# EAGLE design sonar_array (EAGLE 5.09)
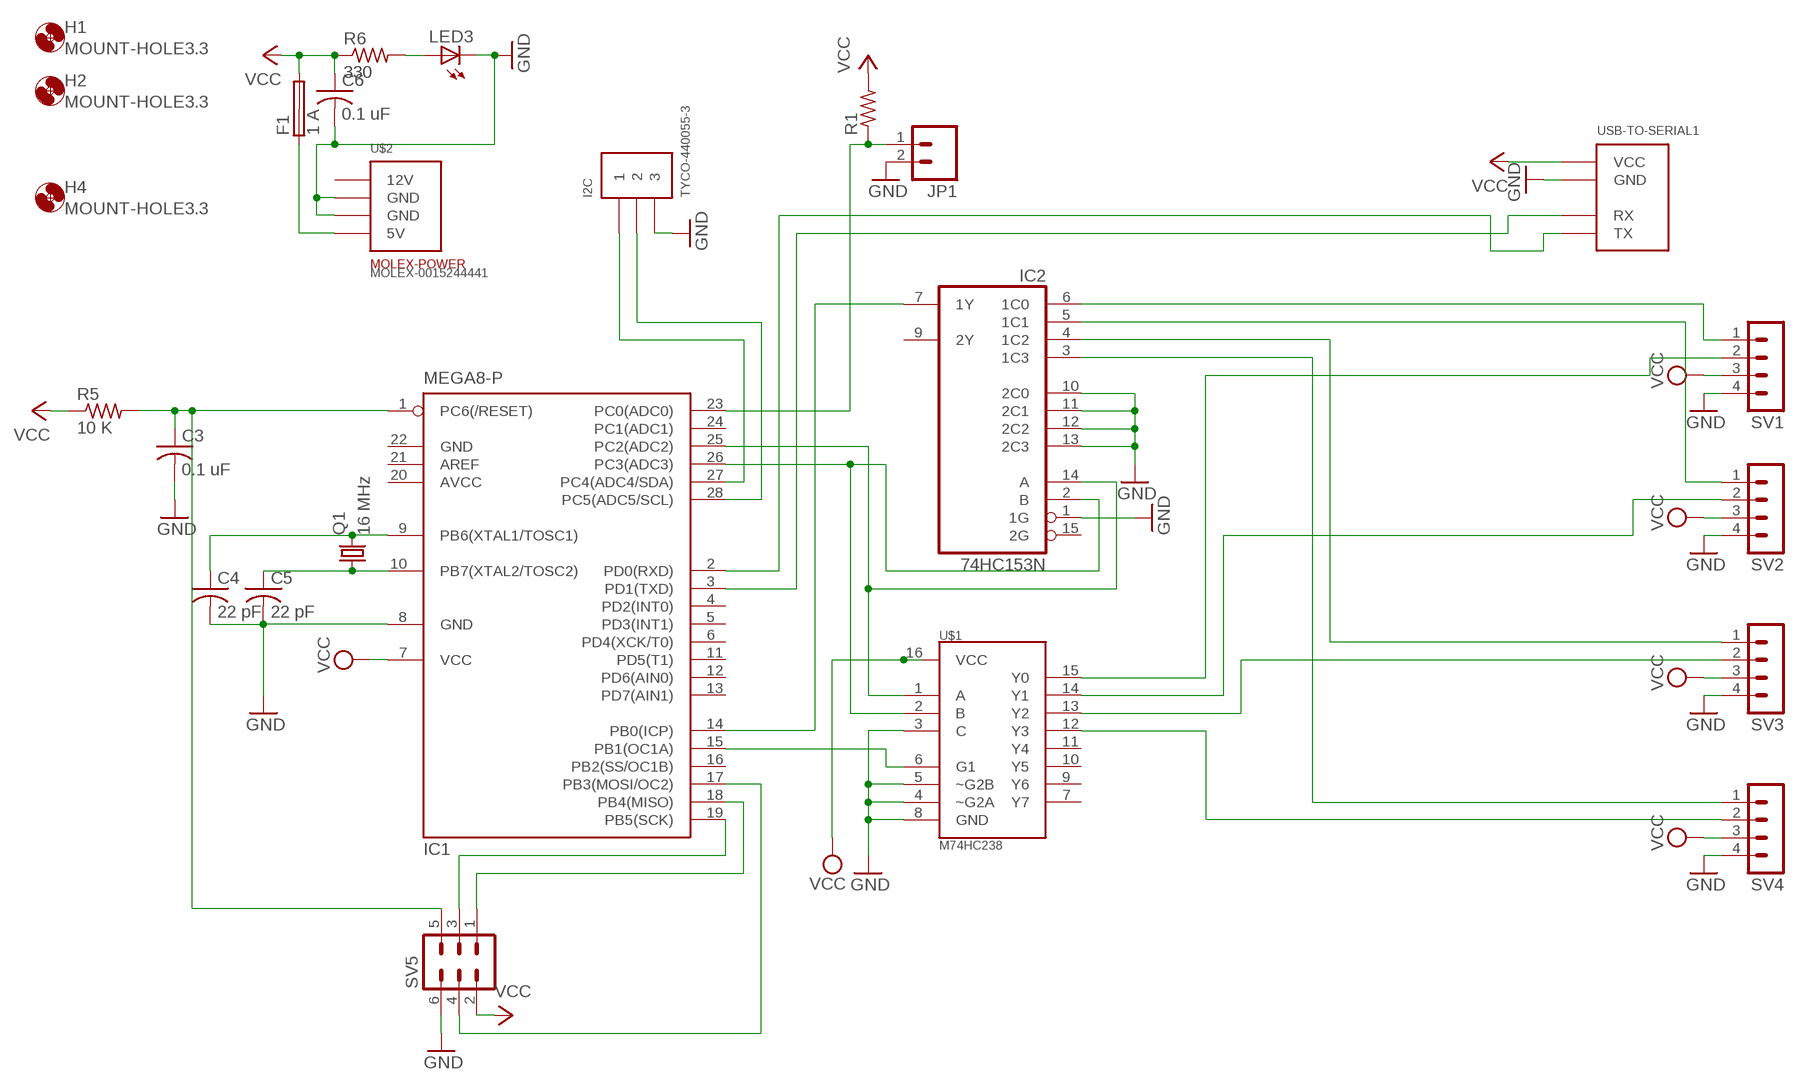
[diagram p0: schematic, sheet 1]

## Parts
C3  0.1 uF  C-US050-055X075  [C050-055X075]
C4  22 pF  C-US025-025X050  [C025-025X050]
C5  22 pF  C-US025-025X050  [C025-025X050]
C6  0.1 uF  C-US050-055X075  [C050-055X075]
F1  1 A  SHK20Q  [SHK20Q]
H1  MOUNT-HOLE3.3  [3,3]
H2  MOUNT-HOLE3.3  [3,3]
H4  MOUNT-HOLE3.3  [3,3]
I2C  TYCO-440055-3  [HEADER-RA-2.00MM-3]
IC1  MEGA8-P  [DIL28-3]
IC2  74HC153N  [DIL16]
JP1  M02  [1X02_LONGPADS]
LED3  LED3MM  [LED3MM]
Q1  16 MHz  CRYSTALHC18U-V  [HC18U-V]
R1  R-US_0207/10  [0207/10]
R5  10 K  R-US_0207/10  [0207/10]
R6  330  R-US_0207/10  [0207/10]
SV1  MA04-1  [MA04-1]
SV2  MA04-1  [MA04-1]
SV3  MA04-1  [MA04-1]
SV4  MA04-1  [MA04-1]
SV5  MA03-2  [MA03-2]
U$1  M74HC238  [DIL16]
U$2  MOLEX-0015244441  [MOLEX-0015244441B]
USB-TO-SERIAL1  USB-TO-SERIAL-SQUARE  [USB-TO-SERIAL.SQUARE]

## Nets
GND: C3.2 C4.2 C5.2 C6.2 I2C.3 IC1.8(GND) IC2.1(1G) IC2.10(2C0) IC2.11(2C1) IC2.12(2C2) IC2.13(2C3) JP1.2 LED3.K(C) SV1.4 SV2.4 SV3.4 SV4.4 SV5.6 U$1.3(C) U$1.4(~G2A) U$1.5(~G2B) U$1.8(GND) U$2.2(GND) U$2.3(GND) USB-TO-SERIAL1.GND
N$1: IC2.6(1C0) SV1.1
N$2: IC2.5(1C1) SV2.1
N$3: IC2.4(1C2) SV3.1
N$4: SV1.2 U$1.15(Y0)
N$5: IC2.3(1C3) SV4.1
N$6: SV2.2 U$1.14(Y1)
N$7: SV3.2 U$1.13(Y2)
N$8: SV4.2 U$1.12(Y3)
N$9: IC1.14(PB0(ICP)) IC2.7(1Y)
N$10: IC1.25(PC2(ADC2)) IC2.14(A) U$1.1(A)
N$11: IC1.26(PC3(ADC3)) IC2.2(B) U$1.2(B)
N$12: IC1.23(PC0(ADC0)) JP1.1 R1.1
N$13: IC1.19(PB5(SCK)) SV5.3
N$14: IC1.18(PB4(MISO)) SV5.1
N$15: IC1.17(PB3(MOSI/OC2)) SV5.4
N$20: IC1.2(PD0(RXD)) USB-TO-SERIAL1.TX
N$21: IC1.3(PD1(TXD)) USB-TO-SERIAL1.RX
N$22: C3.1 IC1.1(PC6(/RESET)) R5.2 SV5.5
N$23: C5.1 IC1.10(PB7(XTAL2/TOSC2)) Q1.1
N$24: C4.1 IC1.9(PB6(XTAL1/TOSC1)) Q1.2
N$25: LED3.A R6.2
N$26: IC1.15(PB1(OC1A)) U$1.6(G1)
N$27: I2C.1 IC1.27(PC4(ADC4/SDA))
N$28: I2C.2 IC1.28(PC5(ADC5/SCL))
N$29: F1.1A U$2.4(5V)
VCC: C6.1 F1.2A IC1.7(VCC) R1.2 R5.1 R6.1 SV1.3 SV2.3 SV3.3 SV4.3 SV5.2 U$1.16(VCC) USB-TO-SERIAL1.VCC
Unconnected: F1.1B F1.2B IC1.4(PD2(INT0)) IC1.5(PD3(INT1)) IC1.6(PD4(XCK/T0)) IC1.11(PD5(T1)) IC1.12(PD6(AIN0)) IC1.13(PD7(AIN1)) IC1.16(PB2(SS/OC1B)) IC1.21(AREF) IC1.24(PC1(ADC1)) IC2.9(2Y) IC2.15(2G) U$1.7(Y7) U$1.9(Y6) U$1.10(Y5) U$1.11(Y4)

## Power pins joined to a net without a drawn wire
12V: U$2.1(12V)
AVCC: IC1.20(AVCC)
GND: IC1.22(GND) IC2.8(GND)
VCC: IC2.16(VCC)

## Library data of the parts
C3-C6 = resistor:C-US: CAPACITOR, American symbol
F1 = fuse:SHK20Q: FUSE HOLDER 5 x 20 mm, SH contact, E1207 Buerklin 64G6061
H1 H2 H4 = holes:MOUNT-HOLE: MOUNTING HOLE with drill center marker
I2C = chicagoedt:TYCO-440055-3: 3 pin right angle header with shroud and 2.00 mm pitch.
IC1 = atmel:MEGA8-P: MICROCONTROLLER 8 Kbytes FLASH, 1 kbytes SRAM, 512 bytes EEPROM, USART, 4-channel 10 bit ADC, 2-channel 8 bit ADC Pin compatible with Atmega48, ATMega88, ATMega168 Source: avr.lbr
IC2 = 74xx-eu:74*153: Dual 4-line to 1-line data SELECTOR/MULTIPLEXER
JP1 = SparkFun:M02: Header 2 Standard 2-pin 0.1" header. Use with straight break away headers (SKU : PRT-00116), right angle break away headers (PRT-00553), swiss pins (PRT-00743), machine pins (PRT-00117), and female headers (PRT-00115). Molex polarized connector foot print use with SKU : PRT-08233 with associated crimp pins and housings.
LED3 = led:LED: LED OSRAM: - CHIPLED LG R971, LG N971, LY N971, LG Q971, LY Q971, LO R971, LY R971 LH N974, LH R974 LS Q976, LO Q976, LY Q976 LO Q996 - Hyper CHIPLED LW Q18S LB Q993, LB Q99A, LB R99A - SideLED LS A670, LO A670, LY A670, LG A670, LP A670 LB A673, LV A673, LT A673, LW A673 LH A674 LY A675 LS A676, LA A676, LO A676, LY A676, LW A676 LS A679, LY A679, LG A679 - Hyper Micro SIDELED® LS Y876, LA Y876, LO Y876, LY Y876 LT Y87S - SmartLED LW L88C, LW L88S LB L89C, LB L89S, LG L890 LS L89K, LO L89K, LY L89K LS L896, LA L896, LO L896, LY L896 - TOPLED LS T670, LO T670, LY T670, LG T670, LP T670 LSG T670, LSP T670, LSY T670, LOP T670, LYG T670 LG T671, LOG T671, LSG T671 LB T673, LV T673, LT T673, LW T673 LH T674 LS T676, LA T676, LO T676, LY T676, LB T676, LH T676, LSB T676, LW T676 LB T67C, LV T67C, LT T67C, LS T67K, LO T67K, LY T67K, LW E67C LS E67B, LA E67B, LO E67B, LY E67B, LB E67C, LV E67C, LT E67C LW T67C LS T679, LY T679, LG T679 LS T770, LO T770, LY T770, LG T770, LP T770 LB T773, LV T773, LT T773, LW T773 LH T774 LS E675, LA E675, LY E675, LS T675 LS T776, LA T776, LO T776, LY T776, LB T776 LHGB T686 LT T68C, LB T68C - Hyper Mini TOPLED® LB M676 - Mini TOPLED Santana® LG M470 LS M47K, LO M47K, LY M47K Source: http://www.osram.convergy.de LUXEON: - LUMILED® LXK2-PW12-R00, LXK2-PW12-S00, LXK2-PW14-U00, LXK2-PW14-V00 LXK2-PM12-R00, LXK2-PM12-S00, LXK2-PM14-U00 LXK2-PE12-Q00, LXK2-PE12-R00, LXK2-PE12-S00, LXK2-PE14-T00, LXK2-PE14-U00 LXK2-PB12-K00, LXK2-PB12-L00, LXK2-PB12-M00, LXK2-PB14-N00, LXK2-PB14-P00, LXK2-PB14-Q00 LXK2-PR12-L00, LXK2-PR12-M00, LXK2-PR14-Q00, LXK2-PR14-R00 LXK2-PD12-Q00, LXK2-PD12-R00, LXK2-PD12-S00 LXK2-PH12-R00, LXK2-PH12-S00 LXK2-PL12-P00, LXK2-PL12-Q00, LXK2-PL12-R00 Source: www.luxeon.com KINGBRIGHT: KA-3528ASYC Source: www.kingbright.com
Q1 = crystal:CRYSTAL: CRYSTAL
R1 R5 R6 = resistor:R-US_: RESISTOR, American symbol
SV1-SV4 = con-lstb:MA04-1: PIN HEADER
SV5 = con-lstb:MA03-2: PIN HEADER
U$1 = SparkFun:M74HC238: M74HC238 - CMOS 3 TO 8 LINE DECODER
U$2 = chicagoedt:MOLEX-0015244441: 5.08mm (.200") Pitch Disk Drive Power Connection System Header, Right Angle, Through Hole, 4 Circuits, Lead-free, 3.56mm (.140") PC Tail Length, with PCB Locator Peg
USB-TO-SERIAL1 = chicagoedt:USB-TO-SERIAL-SQUARE

## Board
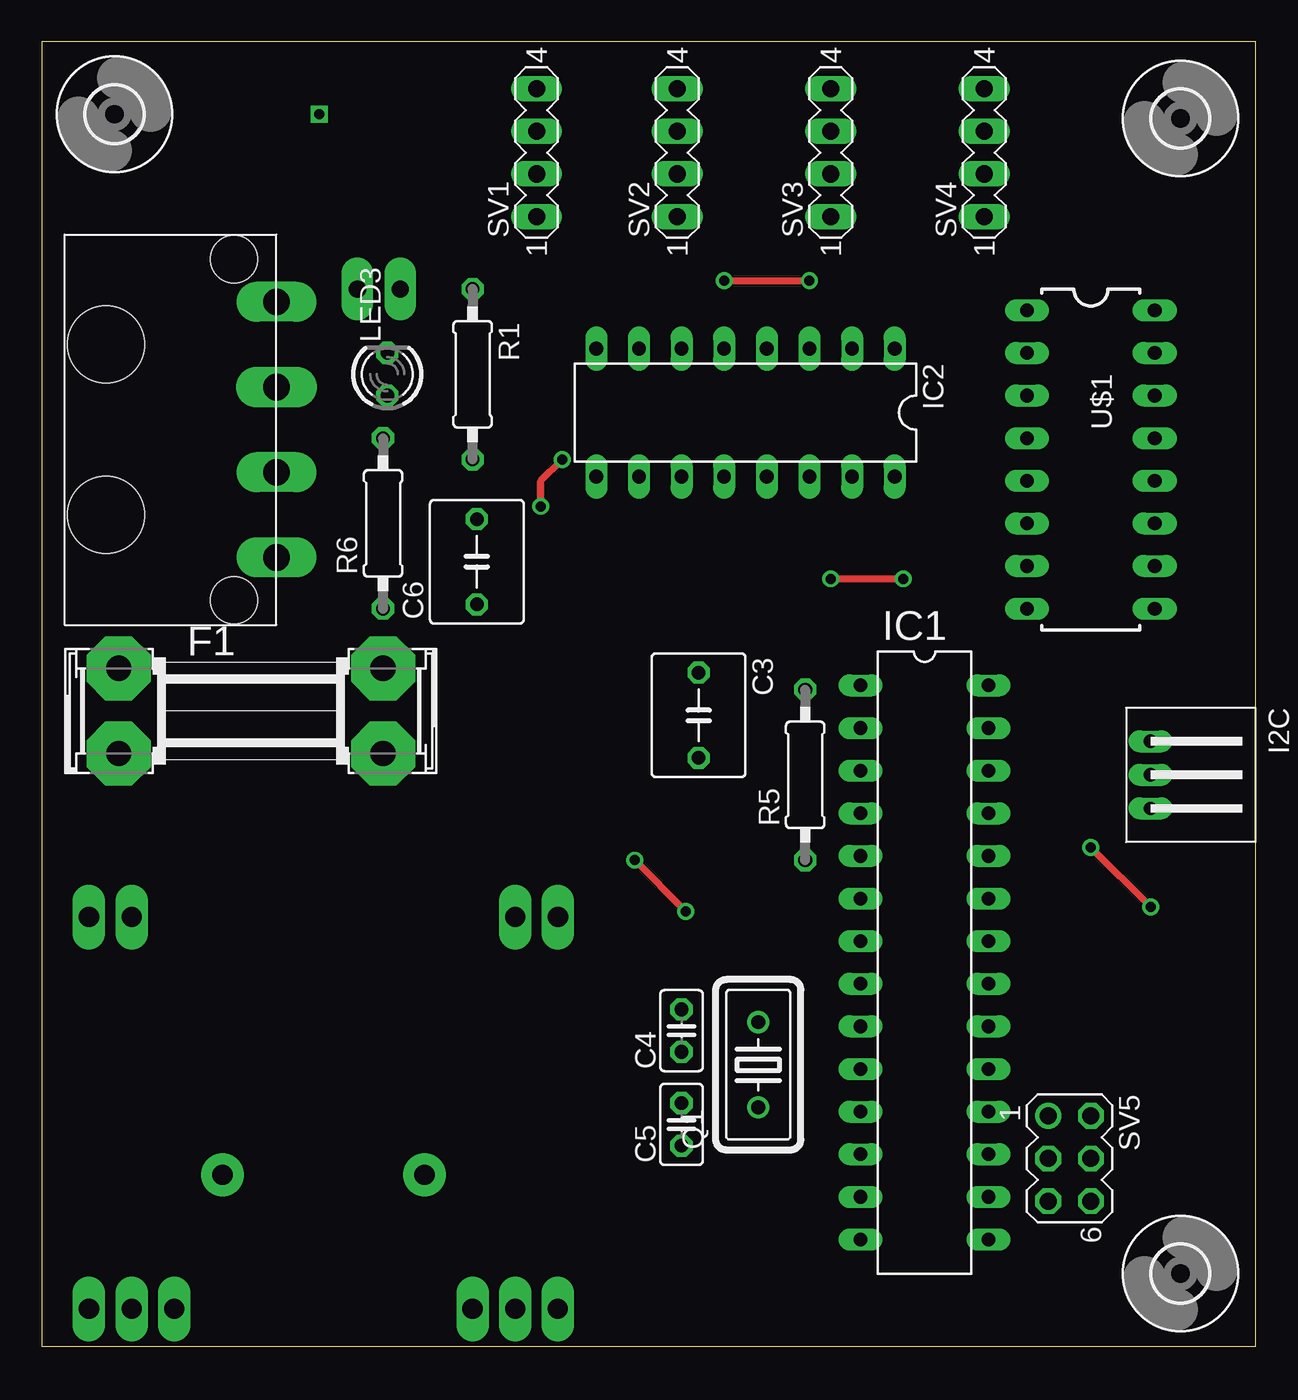
[diagram p1: board, top side]
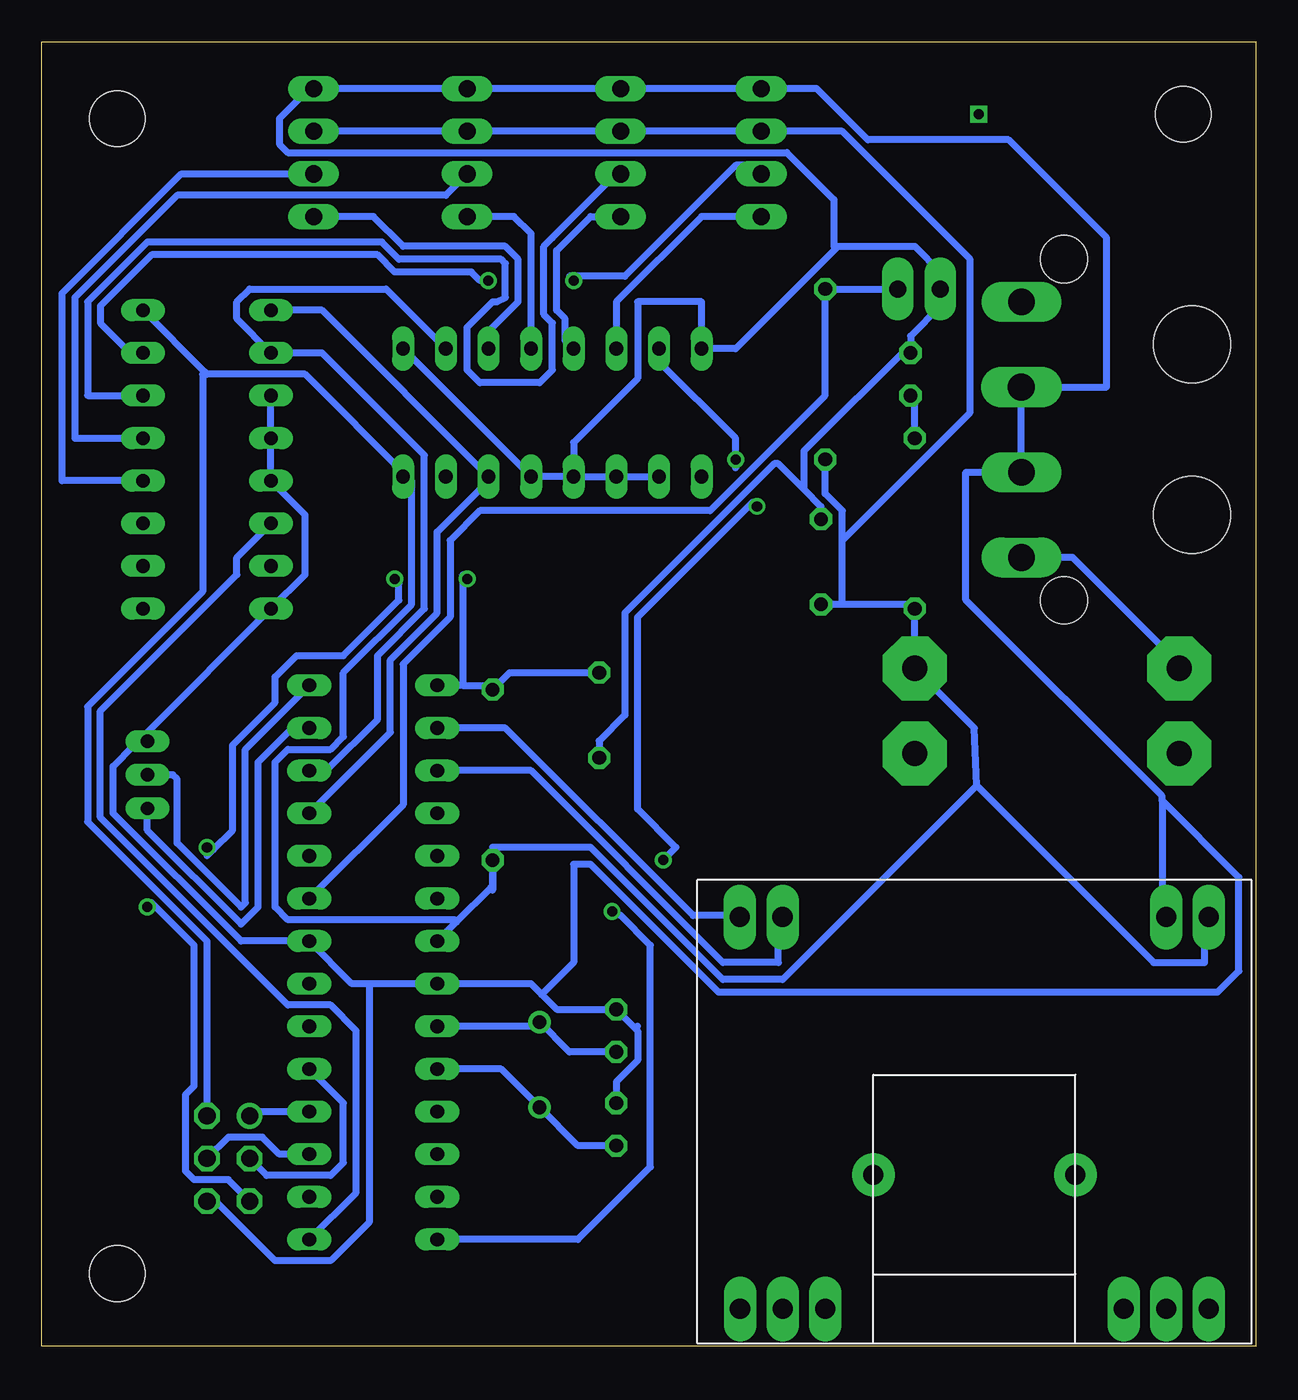
[diagram p2: board, bottom side, seen from below]

Size 72.31 x 77.71 mm. Coordinates in mm from the lower left corner, seen from the top.
Outline: 0,0 72.31,0 72.31,77.71 0,77.71 0,0
Copper layers (1*16): Top 0.035mm / dielectric 1.5mm / Bottom 0.035mm
Design rules "default *": minimum track width 16mil, minimum drill 24mil, track to track 12mil, track to pad 12mil, pad to pad 12mil, via to via 10mil, smd to smd 10mil, copper to edge 40mil, drill to drill 8mil, minimum pad ring 10mil, minimum via ring 8mil, stop-mask expansion 4mil, vias tented up to drill 0mil, thermal gap 10mil

### Footprints (pad centres in the part's own frame; a part is rotated, then mirrored left to right if it is on the bottom)
C050-055X075 = drill 0.813 octagon: 1 -2.54,0; 2 2.54,0
C025-025X050 = drill 0.813 octagon: 1 -1.27,0; 2 1.27,0
SHK20Q = drill 1.5 pad 3.81 octagon: 1A -7.874,2.54; 1B -7.874,-2.54; 2A 7.874,2.54; 2B 7.874,-2.54
3,3 = hole 3.3: 0,0
HEADER-RA-2.00MM-3 = drill 0.8 long: 1 2,0; 2 0,0; 3 -2,0
DIL28-3 = drill 0.813 long: 1 -16.51,-3.81; 2 -13.97,-3.81; 3 -11.43,-3.81; 4 -8.89,-3.81; 5 -6.35,-3.81; 6 -3.81,-3.81; 7 -1.27,-3.81; 8 1.27,-3.81; 9 3.81,-3.81; 10 6.35,-3.81; 11 8.89,-3.81; 12 11.43,-3.81; 13 13.97,-3.81; 14 16.51,-3.81; 15 16.51,3.81; 16 13.97,3.81; 17 11.43,3.81; 18 8.89,3.81; 19 6.35,3.81; 20 3.81,3.81; 21 1.27,3.81; 22 -1.27,3.81; 23 -3.81,3.81; 24 -6.35,3.81; 25 -8.89,3.81; 26 -11.43,3.81; 27 -13.97,3.81; 28 -16.51,3.81
DIL16 = drill 0.813 long: 1 -8.89,-3.81; 2 -6.35,-3.81; 3 -3.81,-3.81; 4 -1.27,-3.81; 5 1.27,-3.81; 6 3.81,-3.81; 7 6.35,-3.81; 8 8.89,-3.81; 9 8.89,3.81; 10 6.35,3.81; 11 3.81,3.81; 12 1.27,3.81; 13 -1.27,3.81; 14 -3.81,3.81; 15 -6.35,3.81; 16 -8.89,3.81
1X02_LONGPADS = drill 1.016 pad 1.88 long: 1 0,0; 2 2.54,0
LED3MM = drill 0.813 octagon: A -1.27,0; K 1.27,0
HC18U-V = drill 0.813 round: 1 -2.54,0; 2 2.54,0
0207/10 = drill 0.813 octagon: 1 -5.08,0; 2 5.08,0
MA04-1 = drill 1.016 long: 1 -3.81,0; 2 -1.27,0; 3 1.27,0; 4 3.81,0
MA03-2 = drill 1.016 round: 1 -2.54,-1.27 | drill 1.016 octagon: 2 -2.54,1.27; 3 0,-1.27; 4 0,1.27; 5 2.54,-1.27; 6 2.54,1.27
MOLEX-0015244441B = drill 1.587 pad 1.778 long: 1 7.62,-6.35; 3 -2.54,-6.35; 4 -7.62,-6.35 | drill 1.6 pad 1.651 long: 2 2.54,-6.35 | hole 2.794: -10.16,-3.81; 10.16,-3.81 | hole 4.572: -5.08,3.81; 5.08,3.81
USB-TO-SERIAL.SQUARE = drill 1.2 pad 1.93 long: GND 11.595,11.425; P$1 -11.76,13.965; P$2 -11.76,11.425; P$3 -11.76,8.885; P$4 -11.76,-8.885; P$7 -11.76,-11.425; P$8 -11.76,-13.965; RX 11.595,-11.435; TX 11.595,-13.975; VCC 11.595,13.965 | drill 1.2 pad 2.54 round: P$5 -3.771,-6.023; P$6 -3.771,6.01

### Placement (x,y rotation side)
C3  39.12,37.59 270 top
C4  38.1,18.8 90 top
C5  38.1,13.21 90 top
C6  25.91,46.74 90 top
F1  12.45,37.85 0 top
H1  67.82,73.15 0 top
H2  67.82,4.32 0 top
H4  4.32,73.41 0 top
I2C  66.04,34.04 270 top
IC1  52.58,22.86 270 top
IC2  41.91,55.63 180 top
JP1  21.34,62.99 180 top
LED3  20.57,57.91 90 top
Q1  42.67,16.76 90 top
R1  25.65,57.91 270 top
R5  45.47,34.04 90 top
R6  20.32,49.02 90 top
SV1  29.46,71.12 90 top
SV2  37.85,71.12 90 top
SV3  46.99,71.12 90 top
SV4  56.13,71.12 90 top
SV5  61.21,11.18 270 top
U$1  62.48,52.83 270 top
U$2  7.62,54.61 90 top
USB-TO-SERIAL1  16.76,13.97 90 top

### Tracks (layer width: path | path; a pad name or v marks a point on that pad's centre or on a via)
GND
  Bottom 0.406: U$1.3 U$1.4 U$1.5 56.64,49.53 56.64,45.97 U$1.8 66.04,36.58 I2C.3 66.04,35.81 66.8,35.81 68.07,34.54 68.07,31.75 60.45,24.13 IC1.22 53.85,21.59 52.83,21.59 | C5.2 38.1,15.75 36.83,17.02 36.83,18.8 36.96,18.92 | 36.96,18.92 C4.2 41.66,20.07 42.55,20.95 | 52.83,21.59 IC1.8 43.18,21.59 42.55,20.95 | SV5.6 61.98,8.64 58.42,5.08 55.12,5.08 52.83,7.37 52.83,21.59 | IC2.10 IC2.11 IC2.12 | IC2.12 IC2.13 IC2.1 | IC2.12 40.64,53.85 36.83,57.66 36.83,62.23 33.02,62.23 IC2.8 30.99,59.44 25.02,65.41 | 20.57,59.69 20.57,60.2 18.8,61.98 JP1.2 18.8,64.01 20.32,65.53 24.89,65.53 25.02,65.41 | 26.92,51.05 25.91,50.04 C6.2 | 26.92,51.05 26.92,53.34 20.57,59.69 | 20.57,59.69 LED3.K | C3.2 39.12,36.07 37.59,37.59 37.59,43.69 28.7,52.58 28.45,52.58 26.92,51.05 | 5.59,32.51 5.59,32.77 17.27,44.45 17.27,52.07 U$2.3 U$2.2 8.89,57.15 8.89,66.04 14.73,71.88 23.11,71.88 26.16,74.93 SV1.4 SV2.4 SV3.4 SV4.4 56.39,74.93 58.17,73.15 58.17,71.63 57.66,71.12 27.94,71.12 25.15,68.33 25.15,65.53 25.02,65.41 | 5.59,32.51 5.59,25.65 USB-TO-SERIAL1.GND | 5.59,32.51 1.02,27.94 1.02,22.35 2.29,21.08 32,21.08 39.62,28.7 40.64,28.7 40.64,22.86 42.55,20.95 | 36.96,18.92 36.83,19.05
N$1
  Bottom 0.406: IC2.6 38.1,62.23 33.02,67.31 30.23,67.31 SV1.1
N$2
  Bottom 0.406: SV2.1 39.62,67.31 41.66,65.28 41.66,61.72 41.15,61.21 41.15,59.94 IC2.5
N$3
  Bottom 0.406: IC2.4 43.18,66.29 44.2,67.31 SV3.1
N$4  (via drill 0.6)
  Top 0.406: v40.64,63.5 v45.72,63.5
  Bottom 0.406: 40.64,63.75 37.59,63.75 30.99,70.36 29.97,70.36 SV1.2 | 40.64,63.75 40.89,63.75 | v45.72,63.5 46.23,63.5 46.74,64.01 51.31,64.01 52.32,65.02 65.79,65.02 68.83,61.98 68.83,60.96 67.06,59.18 U$1.15 | 40.64,63.75 v40.64,63.5
N$5
  Bottom 0.406: IC2.3 45.72,60.45 43.94,62.23 43.94,64.77 44.7,65.53 50.8,65.53 52.58,67.31 SV4.1
N$6
  Bottom 0.406: U$1.14 69.6,56.64 69.6,62.23 66.04,65.79 52.07,65.79 51.05,64.77 44.96,64.77 44.7,64.52 44.7,62.48 45.21,62.23 45.47,62.23 46.99,60.71 46.99,58.17 46.23,57.4 42.67,57.4 41.91,58.17 41.91,60.96 42.42,61.47 42.42,65.53 41.91,66.04 38.1,69.85 SV2.2
N$7
  Bottom 0.406: U$1.13 70.36,54.1 70.36,62.48 64.26,68.58 48.26,68.58 SV3.2
N$8
  Bottom 0.406: U$1.12 71.12,51.56 71.12,62.74 64.01,69.85 SV4.2
N$9  (via drill 0.6)
  Top 0.406: v29.72,50.04 29.72,51.56 v30.99,52.83 | v38.35,25.91 v35.31,28.96
  Bottom 0.406: 30.99,52.32 v30.99,52.83 30.99,54.1 35.56,58.67 IC2.7 | v29.72,50.04 29.97,50.29 36.83,43.43 36.83,32 34.54,29.72 v35.31,28.96 | v38.35,25.91 37.85,25.65 36.07,23.88 36.07,10.67 40.39,6.35 IC1.14
N$10
  Bottom 0.406: U$1.1 55.63,61.72 IC2.14 45.97,51.82 45.97,51.31 48.77,48.51 48.77,43.69 51.56,40.89 51.56,36.58 IC1.25
N$11
  Bottom 0.406: IC2.2 51.82,62.99 59.94,62.99 60.71,62.23 60.71,61.21 U$1.2 55.63,59.18 49.53,53.09 49.53,43.94 52.32,41.15 52.32,37.34 55.37,34.29 IC1.26
N$12
  Bottom 0.406: JP1.1 R1.1 25.65,56.64 32.51,49.78 46.23,49.78 48.01,48.01 48.01,43.43 50.8,40.64 50.8,32.26 IC1.23
N$13
  Bottom 0.406: IC1.19 54.36,14.48 54.36,10.92 55.12,10.16 58.93,10.16 SV5.3
N$14
  Bottom 0.406: IC1.18 59.69,13.97 SV5.1
N$15
  Bottom 0.406: IC1.17 58.17,11.43 59.18,12.45 61.21,12.45 SV5.4
N$16  (via drill 0.6)
  other vias: 16.51,73.41
N$20
  Bottom 0.406: IC1.2 44.7,36.83 33.53,25.65 30.99,25.65 USB-TO-SERIAL1.TX
N$21
  Bottom 0.406: IC1.3 43.18,34.29 31.75,22.86 28.45,22.86 28.45,25.4 USB-TO-SERIAL1.RX
N$22  (via drill 0.6)
  Top 0.406: v51.31,45.72 v46.99,45.72 | v66.04,26.16 v62.48,29.72
  Bottom 0.406: C3.1 44.45,40.13 R5.2 45.47,39.37 47.24,39.37 | 47.24,39.37 IC1.1 | 47.24,45.72 47.24,39.37 | 47.24,45.72 47.24,45.97 | v46.99,45.72 47.24,45.72 | 62.1,29.59 60.96,30.73 60.96,35.81 58.42,38.35 58.42,39.88 57.15,41.15 54.36,41.15 51.05,44.45 51.05,45.47 v51.31,45.72 | 62.1,29.59 62.48,29.21 | v62.48,29.72 62.23,29.72 62.1,29.59 | SV5.5 61.21,9.91 63.25,9.91 63.75,10.41 63.75,14.99 63.25,15.49 63.25,23.88 65.79,26.42 v66.04,26.16
N$23
  Bottom 0.406: C5.1 40.39,11.94 Q1.1 44.96,16.51 IC1.10
N$24
  Bottom 0.406: C4.1 40.89,17.53 Q1.2 42.67,19.05 IC1.9
N$25
  Bottom 0.406: R6.2 20.32,56.39 LED3.A
N$26
  Bottom 0.406: IC1.15 53.59,9.14 53.59,18.8 55.12,20.32 57.66,20.32 68.83,31.5 68.83,37.85 60.71,45.97 60.71,46.99 U$1.6
N$27
  Bottom 0.406: IC1.27 57.4,36.83 59.44,34.8 59.44,26.16 60.45,25.15 66.04,30.73 66.04,32.26 I2C.1
N$28
  Bottom 0.406: IC1.28 60.2,35.56 60.2,26.42 60.45,26.16 64.26,29.97 64.26,33.78 64.52,34.04 I2C.2
N$29
  Bottom 0.406: U$2.4 10.92,46.99 4.57,40.64 F1.1A
VCC
  Bottom 0.406: 50.55,51.82 IC2.16 | 50.55,51.82 56.64,57.91 62.48,57.91 62.61,58.04 | 62.61,58.04 U$1.16 | SV5.2 62.48,24.13 69.6,31.24 69.6,38.1 62.74,44.96 62.74,57.91 62.61,58.04 | SV4.3 SV3.3 SV2.3 SV1.3 24.64,72.39 17.02,64.77 17.02,55.63 24.64,48.01 | R5.1 45.47,27.43 45.59,27.3 | 47.62,25.27 IC1.7 | 45.59,27.3 47.62,25.27 | 24.64,44.2 20.57,44.2 R6.1 F1.2A 16.76,36.83 16.64,33.4 | 24.64,44.2 C6.1 | R1.2 25.65,50.8 24.64,49.78 24.64,48.01 | 24.64,44.2 24.64,48.01 | 16.64,33.4 6.1,22.86 3.05,22.86 3.05,25.4 USB-TO-SERIAL1.VCC | 45.59,27.3 45.47,27.18 45.47,29.72 39.62,29.72 31.75,21.84 28.19,21.84 16.64,33.4 | 50.55,51.82 50.29,51.56 50.29,44.2 54.36,40.13 54.36,36.32 55.12,35.56 57.66,35.56 58.42,34.8 58.42,26.16 57.66,25.4 47.75,25.4 47.62,25.27